# EAGLE design nrf-beacon (EAGLE 6.5.0)
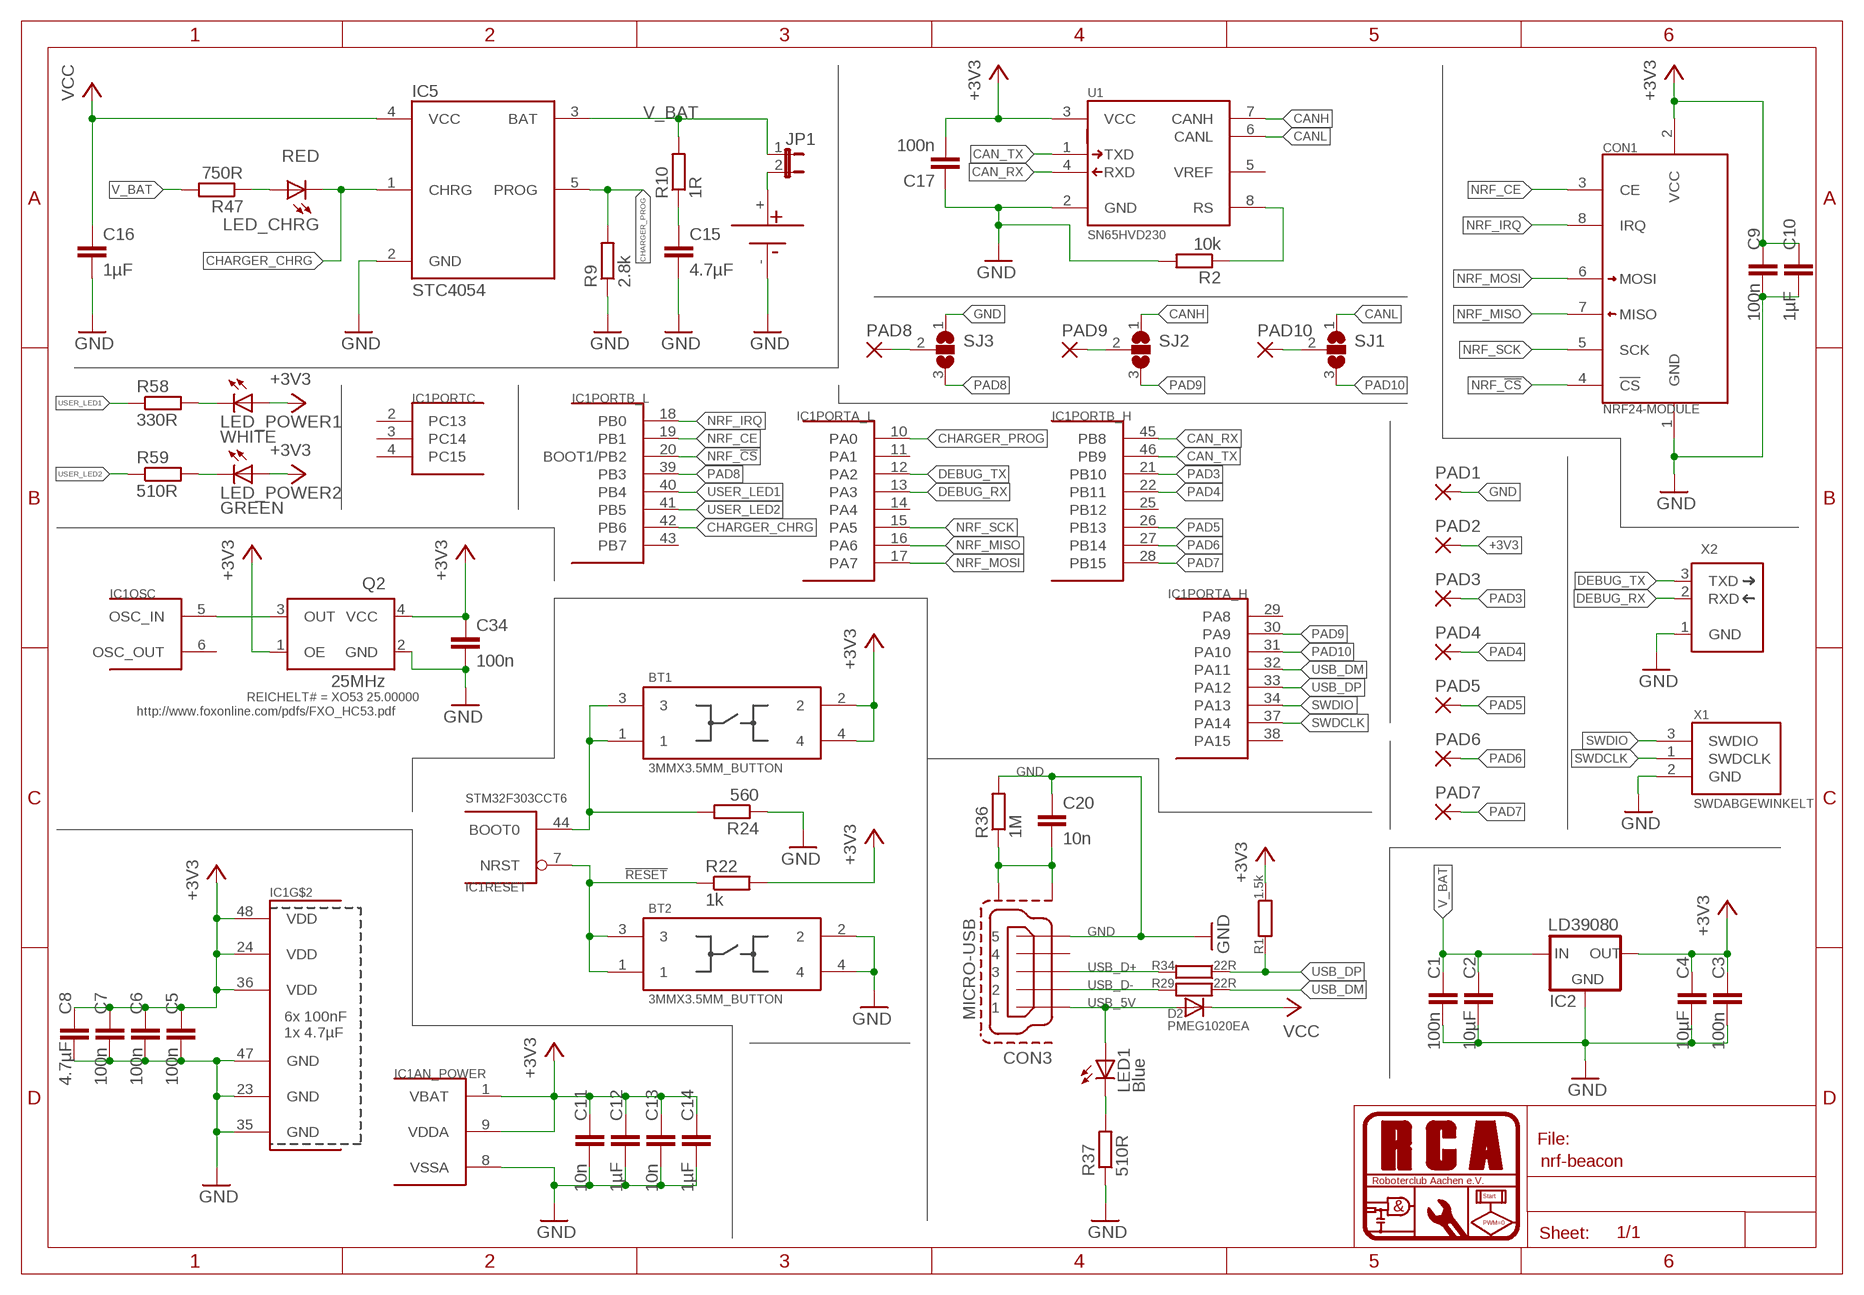
[diagram p0: schematic, sheet 1]

## Parts
BT1  3MMX3.5MM_BUTTON  [3MMX3.5MM_BUTTON]
BT2  3MMX3.5MM_BUTTON  [3MMX3.5MM_BUTTON]
C1  100n  C-EUC1206  [C1206]
C2  10µF  C-EUC1206  [C1206]
C3  100n  C-EUC1206  [C1206]
C4  10µF  C-EUC1206  [C1206]
C5  100n  C-EUC0603  [C0603]
C6  100n  C-EUC0603  [C0603]
C7  100n  C-EUC0603  [C0603]
C8  4.7µF  C-EUC0603  [C0603]
C9  100n  C-EUC0603  [C0603]
C10  1µF  C-EUC0603  [C0603]
C11  10n  C-EUC0603  [C0603]
C12  1µF  C-EUC0603  [C0603]
C13  10n  C-EUC0603  [C0603]
C14  1µF  C-EUC0603  [C0603]
C15  4.7µF  C-EUC0603  [C0603]
C16  1µF  C-EUC0603  [C0603]
C17  100n  C-EUC1206  [C1206]
C20  10n  C-EUC0805  [C0805]
C34  100n  C-EUC0603  [C0603]
CON1  NRF24-MODULE  [NRF24-MODULE]
CON3  MICRO-USB  [MICRO-USB]
D2  PMEG1020EA  DIODE-SOD323-W  [SOD323-W]
IC1  STM32F303CCT6  [TQFP48]
IC2  LD39080  [DPAK]
IC5  STC4054  [SOT23-5L]
JP1  JP1E  [JP1]
LED1  Blue  LEDCHIPLED_0805  [CHIPLED_0805]
LED_CHRG  RED  LEDCHIPLED_0805  [CHIPLED_0805]
LED_POWER1  WHITE  LEDCHIPLED_0805  [CHIPLED_0805]
LED_POWER2  GREEN  LEDCHIPLED_0805  [CHIPLED_0805]
PAD1  WIREPADSMD5-1,8  [5-1,8]
PAD2  WIREPADSMD5-1,8  [5-1,8]
PAD3  WIREPADSMD5-1,8  [5-1,8]
PAD4  WIREPADSMD5-1,8  [5-1,8]
PAD5  WIREPADSMD5-1,8  [5-1,8]
PAD6  WIREPADSMD5-1,8  [5-1,8]
PAD7  WIREPADSMD5-1,8  [5-1,8]
PAD8  WIREPADSMD5-1,8  [5-1,8]
PAD9  WIREPADSMD5-1,8  [5-1,8]
PAD10  WIREPADSMD5-1,8  [5-1,8]
Q2  25MHz  XO53  [XO53]
R1  1.5k  R-EU_M0805  [M0805]
R2  10k  R-EU_R0805  [R0805]
R9  2.8k  R-EU_R0603  [R0603]
R10  1R  R-EU_R0805  [R0805]
R22  1k  R-EU_R0603  [R0603]
R24  560  R-EU_R0805  [R0805]
R29  22R  R-EU_M0805  [M0805]
R34  22R  R-EU_M0805  [M0805]
R36  1M  R-EU_M0805  [M0805]
R37  510R  R-EU_M0805  [M0805]
R47  750R  R-EU_R0603  [R0603]
R58  330R  R-EU_R0603  [R0603]
R59  510R  R-EU_R0603  [R0603]
SJ1  SJ2W  [SJ_2]
SJ2  SJ2W  [SJ_2]
SJ3  SJ2W  [SJ_2]
U1  SN65HVD230  [SOIC-8]
U$1  BAT  [BAT]
X1  SWDABGEWINKELT  [7395-03]
X2  SERIAL_DEBUG_3PINL  [7395-03]

## Nets
!RESET: BT2.1 BT2.3 IC1.7(RESET:NRST) R22.1
$234: PAD10.1(P) SJ1.2
$6757: PAD8.1(P) SJ3.2
+3V3: BT1.2 BT1.4 C3.1 C4.1 C5.1 C6.1 C7.1 C8.1 C9.1 C10.1 C11.1 C12.1 C13.1 C14.1 C17.2 C34.1 CON1.2(VCC) IC1.1(AN_POWER:VBAT) IC1.9(AN_POWER:VDDA) IC1.24(VDD) IC1.36(VDD) IC1.48(VDD) IC2.3(OUT) LED_POWER1.A LED_POWER2.A PAD2.1(P) Q2.1(OE) Q2.4(VCC) R1.1 R22.2 U1.3(VCC)
CAN_RX: IC1.45(PORTB_H:PB8) U1.4(RXD)
CAN_TX: IC1.46(PORTB_H:PB9) U1.1(TXD)
CANH: SJ2.1 U1.7(CANH)
CANL: SJ1.1 U1.6(CANL)
CHARGER_CHRG: IC1.42(PORTB_L:PB6) IC5.1(CHRG) LED_CHRG.C
CHARGER_PROG: IC1.10(PORTA_L:PA0) IC5.5(PROG) R9.2
DEBUG_RX: IC1.13(PORTA_L:PA3) X2.2(RXD)
DEBUG_TX: IC1.12(PORTA_L:PA2) X2.3(TXD)
GND: BT2.2 BT2.4 C1.2 C2.2 C3.2 C4.2 C5.2 C6.2 C7.2 C8.2 C9.2 C10.2 C11.2 C12.2 C13.2 C14.2 C15.2 C16.2 C17.1 C20.1 C34.2 CON1.1(GND) CON3.5 IC1.8(AN_POWER:VSSA) IC1.23(GND) IC1.35(GND) IC1.47(GND) IC2.2(GND) IC5.2(GND) PAD1.1(P) Q2.2(GND) R2.2 R9.1 R24.1 R36.2 R37.1 SJ3.1 U1.2(GND) U$1.- X1.2(GND) X2.1(GND)
N$1: JP1.2 U$1.+
N$2: BT1.1 BT1.3 IC1.44(RESET:BOOT0) R24.2
N$3: R2.1 U1.8(RS)
N$4: PAD9.1(P) SJ2.2
N$11: C20.2 CON3.SHIELDING1 CON3.SHIELDING2 R36.1
N$17: LED1.C R37.2
N$19: C15.1 R10.1
N$20: LED_POWER1.C R58.2
N$23: LED_CHRG.A R47.1
N$39: IC1.5(OSC:OSC_IN) Q2.3(OUT)
N$50: LED_POWER2.C R59.2
NRF_!CS: CON1.4(!CS) IC1.20(PORTB_L:BOOT1/PB2)
NRF_CE: CON1.3(CE) IC1.19(PORTB_L:PB1)
NRF_IRQ: CON1.8(IRQ) IC1.18(PORTB_L:PB0)
NRF_MISO: CON1.7(MISO) IC1.16(PORTA_L:PA6)
NRF_MOSI: CON1.6(MOSI) IC1.17(PORTA_L:PA7)
NRF_SCK: CON1.5(SCK) IC1.15(PORTA_L:PA5)
PAD3: IC1.21(PORTB_H:PB10) PAD3.1(P)
PAD4: IC1.22(PORTB_H:PB11) PAD4.1(P)
PAD5: IC1.26(PORTB_H:PB13) PAD5.1(P)
PAD6: IC1.27(PORTB_H:PB14) PAD6.1(P)
PAD7: IC1.28(PORTB_H:PB15) PAD7.1(P)
PAD8: IC1.39(PORTB_L:PB3) SJ3.3
PAD9: IC1.30(PORTA_H:PA9) SJ2.3
PAD10: IC1.31(PORTA_H:PA10) SJ1.3
SWDCLK: IC1.37(PORTA_H:PA14) X1.1(SWDCLK)
SWDIO: IC1.34(PORTA_H:PA13) X1.3(SWDIO)
USB_5V: CON3.1 D2.A LED1.A
USB_D+: CON3.3 R34.2
USB_D-: CON3.2 R29.2
USB_DM: IC1.32(PORTA_H:PA11) R29.1
USB_DP: IC1.33(PORTA_H:PA12) R1.2 R34.1
USER_LED1: IC1.40(PORTB_L:PB4) R58.1
USER_LED2: IC1.41(PORTB_L:PB5) R59.1
V_BAT: C1.1 C2.1 IC2.1(IN) IC5.3(BAT) JP1.1 R10.2 R47.2
VCC: C16.1 D2.C IC5.4(VCC)
Unconnected: CON3.4 IC1.2(PORTC:PC13) IC1.3(PORTC:PC14) IC1.4(PORTC:PC15) IC1.6(OSC:OSC_OUT) IC1.11(PORTA_L:PA1) IC1.14(PORTA_L:PA4) IC1.25(PORTB_H:PB12) IC1.29(PORTA_H:PA8) IC1.38(PORTA_H:PA15) IC1.43(PORTB_L:PB7) U1.5(VREF)

## Notes on the sheet
- http://www.foxonline.com/pdfs/FXO_HC53.pdf

## Library data of the parts
BT1 BT2 = rca_sontiges:3MMX3.5MM_BUTTON
C1-C8 C11-C16 = rcl:C-EU: CAPACITOR, European symbol
C9 C10 = resistor:C-EU: CAPACITOR, European symbol
C17 = resistor:C-EU: CAPACITOR, European symbol; RCA#: C0603 100n
C20 = resistor:C-EU: CAPACITOR, European symbol; RCA#: C0805 10n
C34 = rcl:C-EU: CAPACITOR, European symbol; RCA#: C0603 100n
CON1 = rca_sontiges:NRF24-MODULE: NRF24L01+ 2.4GHz wireless module
CON3 = rca_stecker:MICRO-USB
D2 = diode:DIODE-: DIODE; MANF: NXP; SAMPLE#: PMEG1020EA
IC1 = stm32:STM32F303CCT6: ST STM32F101/103 48pin LQFP
IC2 = rca_spgversorgung:LD39080: Ultra low drop BICMOS voltage regulator - 0.8A Guaranteed output current - Ultra low dropout voltage (150mV typ. @ 0.8A load, 20mV typ. @150mA load)
IC5 = rca_ic:STC4054: 800mA Standalone linear Li-Ion Battery charger programmable charge current up to 800mA No external MOSFET, sense resistors or blocking diode required Constant current / constant voltage operation with thermal regulation to maximize charge rate without risk of overheating Charges single cell li-ion batteries directly from USB port Preset 4.2V charge voltage with 1% accuracy Automatic recharge Single charge status output pin Charge current monitor output for gas gauging C/10 Charge termination 25μA supply current in shutdown mode Low battery voltage detect for precharge setting Soft-start limits inrush current TSOT23-5L package
JP1 = jumper:JP1E: JUMPER
LED1 = led:LED: LED OSRAM: - CHIPLED LG R971, LG N971, LY N971, LG Q971, LY Q971, LO R971, LY R971 LH N974, LH R974 LS Q976, LO Q976, LY Q976 LO Q996 - Hyper CHIPLED LW Q18S LB Q993, LB Q99A, LB R99A - SideLED LS A670, LO A670, LY A670, LG A670, LP A670 LB A673, LV A673, LT A673, LW A673 LH A674 LY A675 LS A676, LA A676, LO A676, LY A676, LW A676 LS A679, LY A679, LG A679 - Hyper Micro SIDELED® LS Y876, LA Y876, LO Y876, LY Y876 LT Y87S - SmartLED LW L88C, LW L88S LB L89C, LB L89S, LG L890 LS L89K, LO L89K, LY L89K LS L896, LA L896, LO L896, LY L896 - TOPLED LS T670, LO T670, LY T670, LG T670, LP T670 LSG T670, LSP T670, LSY T670, LOP T670, LYG T670 LG T671, LOG T671, LSG T671 LB T673, LV T673, LT T673, LW T673 LH T674 LS T676, LA T676, LO T676, LY T676, LB T676, LH T676, LSB T676, LW T676 LB T67C, LV T67C, LT T67C, LS T67K, LO T67K, LY T67K, LW E67C LS E67B, LA E67B, LO E67B, LY E67B, LB E67C, LV E67C, LT E67C LW T67C LS T679, LY T679, LG T679 LS T770, LO T770, LY T770, LG T770, LP T770 LB T773, LV T773, LT T773, LW T773 LH T774 LS E675, LA E675, LY E675, LS T675 LS T776, LA T776, LO T776, LY T776, LB T776 LHGB T686 LT T68C, LB T68C - Hyper Mini TOPLED® LB M676 - Mini TOPLED Santana® LG M470 LS M47K, LO M47K, LY M47K Source: http://www.osram.convergy.de LUXEON: - LUMILED® LXK2-PW12-R00, LXK2-PW12-S00, LXK2-PW14-U00, LXK2-PW14-V00 LXK2-PM12-R00, LXK2-PM12-S00, LXK2-PM14-U00 LXK2-PE12-Q00, LXK2-PE12-R00, LXK2-PE12-S00, LXK2-PE14-T00, LXK2-PE14-U00 LXK2-PB12-K00, LXK2-PB12-L00, LXK2-PB12-M00, LXK2-PB14-N00, LXK2-PB14-P00, LXK2-PB14-Q00 LXK2-PR12-L00, LXK2-PR12-M00, LXK2-PR14-Q00, LXK2-PR14-R00 LXK2-PD12-Q00, LXK2-PD12-R00, LXK2-PD12-S00 LXK2-PH12-R00, LXK2-PH12-S00 LXK2-PL12-P00, LXK2-PL12-Q00, LXK2-PL12-R00 Source: www.luxeon.com KINGBRIGHT: KA-3528ASYC Source: www.kingbright.com; REICHELT#: SMD-LED 0805 BL
LED_CHRG = led:LED: LED OSRAM: - CHIPLED LG R971, LG N971, LY N971, LG Q971, LY Q971, LO R971, LY R971 LH N974, LH R974 LS Q976, LO Q976, LY Q976 LO Q996 - Hyper CHIPLED LW Q18S LB Q993, LB Q99A, LB R99A - SideLED LS A670, LO A670, LY A670, LG A670, LP A670 LB A673, LV A673, LT A673, LW A673 LH A674 LY A675 LS A676, LA A676, LO A676, LY A676, LW A676 LS A679, LY A679, LG A679 - Hyper Micro SIDELED® LS Y876, LA Y876, LO Y876, LY Y876 LT Y87S - SmartLED LW L88C, LW L88S LB L89C, LB L89S, LG L890 LS L89K, LO L89K, LY L89K LS L896, LA L896, LO L896, LY L896 - TOPLED LS T670, LO T670, LY T670, LG T670, LP T670 LSG T670, LSP T670, LSY T670, LOP T670, LYG T670 LG T671, LOG T671, LSG T671 LB T673, LV T673, LT T673, LW T673 LH T674 LS T676, LA T676, LO T676, LY T676, LB T676, LH T676, LSB T676, LW T676 LB T67C, LV T67C, LT T67C, LS T67K, LO T67K, LY T67K, LW E67C LS E67B, LA E67B, LO E67B, LY E67B, LB E67C, LV E67C, LT E67C LW T67C LS T679, LY T679, LG T679 LS T770, LO T770, LY T770, LG T770, LP T770 LB T773, LV T773, LT T773, LW T773 LH T774 LS E675, LA E675, LY E675, LS T675 LS T776, LA T776, LO T776, LY T776, LB T776 LHGB T686 LT T68C, LB T68C - Hyper Mini TOPLED® LB M676 - Mini TOPLED Santana® LG M470 LS M47K, LO M47K, LY M47K Source: http://www.osram.convergy.de LUXEON: - LUMILED® LXK2-PW12-R00, LXK2-PW12-S00, LXK2-PW14-U00, LXK2-PW14-V00 LXK2-PM12-R00, LXK2-PM12-S00, LXK2-PM14-U00 LXK2-PE12-Q00, LXK2-PE12-R00, LXK2-PE12-S00, LXK2-PE14-T00, LXK2-PE14-U00 LXK2-PB12-K00, LXK2-PB12-L00, LXK2-PB12-M00, LXK2-PB14-N00, LXK2-PB14-P00, LXK2-PB14-Q00 LXK2-PR12-L00, LXK2-PR12-M00, LXK2-PR14-Q00, LXK2-PR14-R00 LXK2-PD12-Q00, LXK2-PD12-R00, LXK2-PD12-S00 LXK2-PH12-R00, LXK2-PH12-S00 LXK2-PL12-P00, LXK2-PL12-Q00, LXK2-PL12-R00 Source: www.luxeon.com KINGBRIGHT: KA-3528ASYC Source: www.kingbright.com; REICHELT#: SMD-LED 0805 RT
LED_POWER1 LED_POWER2 = led:LED: LED OSRAM: - CHIPLED LG R971, LG N971, LY N971, LG Q971, LY Q971, LO R971, LY R971 LH N974, LH R974 LS Q976, LO Q976, LY Q976 LO Q996 - Hyper CHIPLED LW Q18S LB Q993, LB Q99A, LB R99A - SideLED LS A670, LO A670, LY A670, LG A670, LP A670 LB A673, LV A673, LT A673, LW A673 LH A674 LY A675 LS A676, LA A676, LO A676, LY A676, LW A676 LS A679, LY A679, LG A679 - Hyper Micro SIDELED® LS Y876, LA Y876, LO Y876, LY Y876 LT Y87S - SmartLED LW L88C, LW L88S LB L89C, LB L89S, LG L890 LS L89K, LO L89K, LY L89K LS L896, LA L896, LO L896, LY L896 - TOPLED LS T670, LO T670, LY T670, LG T670, LP T670 LSG T670, LSP T670, LSY T670, LOP T670, LYG T670 LG T671, LOG T671, LSG T671 LB T673, LV T673, LT T673, LW T673 LH T674 LS T676, LA T676, LO T676, LY T676, LB T676, LH T676, LSB T676, LW T676 LB T67C, LV T67C, LT T67C, LS T67K, LO T67K, LY T67K, LW E67C LS E67B, LA E67B, LO E67B, LY E67B, LB E67C, LV E67C, LT E67C LW T67C LS T679, LY T679, LG T679 LS T770, LO T770, LY T770, LG T770, LP T770 LB T773, LV T773, LT T773, LW T773 LH T774 LS E675, LA E675, LY E675, LS T675 LS T776, LA T776, LO T776, LY T776, LB T776 LHGB T686 LT T68C, LB T68C - Hyper Mini TOPLED® LB M676 - Mini TOPLED Santana® LG M470 LS M47K, LO M47K, LY M47K Source: http://www.osram.convergy.de LUXEON: - LUMILED® LXK2-PW12-R00, LXK2-PW12-S00, LXK2-PW14-U00, LXK2-PW14-V00 LXK2-PM12-R00, LXK2-PM12-S00, LXK2-PM14-U00 LXK2-PE12-Q00, LXK2-PE12-R00, LXK2-PE12-S00, LXK2-PE14-T00, LXK2-PE14-U00 LXK2-PB12-K00, LXK2-PB12-L00, LXK2-PB12-M00, LXK2-PB14-N00, LXK2-PB14-P00, LXK2-PB14-Q00 LXK2-PR12-L00, LXK2-PR12-M00, LXK2-PR14-Q00, LXK2-PR14-R00 LXK2-PD12-Q00, LXK2-PD12-R00, LXK2-PD12-S00 LXK2-PH12-R00, LXK2-PH12-S00 LXK2-PL12-P00, LXK2-PL12-Q00, LXK2-PL12-R00 Source: www.luxeon.com KINGBRIGHT: KA-3528ASYC Source: www.kingbright.com; REICHELT#: SMD-LED 0805 GN
PAD1-PAD10 = wirepad:WIREPAD: Wire PAD connect wire on PCB
Q2 = rca_clock:XO: XO91 Series Oscillators Frequency Range 500 kHz to 125 MHz Supply voltage range 1.8, 2.5, 3.3 or 5.0 Volts Gibt es in der 3,3V Version bei Reichelt (XO91 #Wert) Datenblatt: http://www.reichelt.de/?;ACTION=7;LA=6;OPEN=0;INDEX=0;FILENAME=B400%252FXO91.pdf XO53 Series Oscillators Frequency Range 2.5 MHz to 125 MHz Supply voltage range 1.8, 2.5, 3.3 Volts Gibt es in der 3,3V Version bei Reichelt (XO53 #Wert) XO32 Series Oscillators Frequency Range 8 MHz to 50 MHz Supply voltage range 1.8, 2.5, 3.3 Volts Gibt es in der 3,3V Version bei Reichelt (XO32 #Wert); REICHELT#: XO53 25.00000
R1 R29 R34 = resistor:R-EU_: RESISTOR, European symbol; RCA#: R0805 22R
R2 R9 R10 = rcl:R-EU_: RESISTOR, European symbol
R22 R24 = rcl:R-EU_: RESISTOR, European symbol; RCA#: R0603 10k
R36 = resistor:R-EU_: RESISTOR, European symbol; RCA#: R0805 1M
R37 = resistor:R-EU_: RESISTOR, European symbol; RCA#: R0805 820R
R47 = resistor:R-EU_: RESISTOR, European symbol; DIGIKEY#: RMCF0805JT820RCT-ND; RCA#: R0805 820R
R58 R59 = rcl:R-EU_: RESISTOR, European symbol; DIGIKEY#: 311-560GRCT-ND; RCA#: R0603 560R
SJ1-SJ3 = rca_sontiges:SJ2W: SMD solder JUMPER
U1 = rca_ic:SN65HVD230: 3.3V CAN Transceiver mit Split-Terminierung und Slope-Control
U$1 = akku:BAT: 1 cell battery
X1 = rca_stecker:SWD: SWD Programmierstecker SWD-Interface aus SWDIO+SWDCLK+GND für die Verwendung mit STLinkV2, andere Programmer benötigen möglicherweise auch VCC oder Reset
X2 = rca_stecker:SERIAL_DEBUG_3PIN

## Board
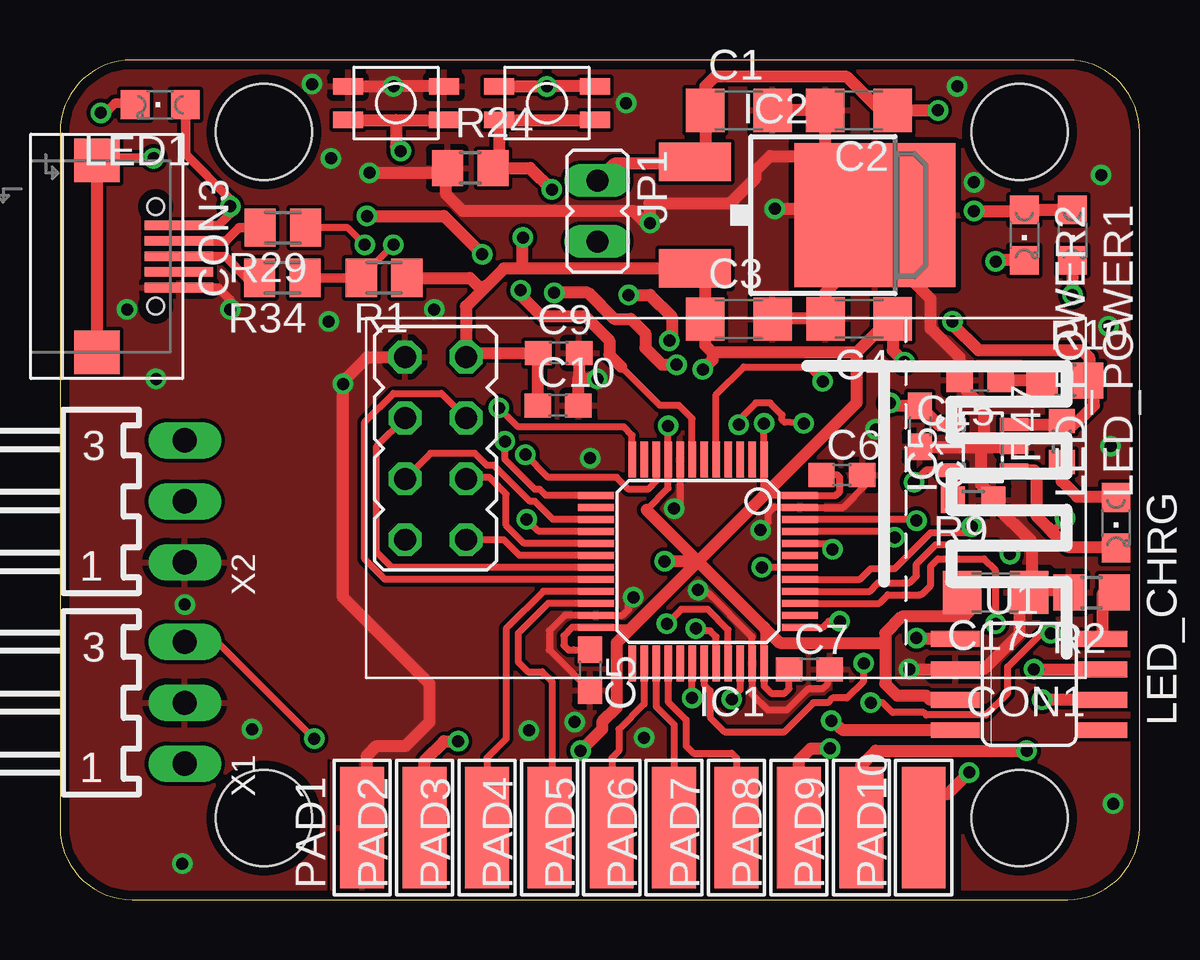
[diagram p1: board, top side]
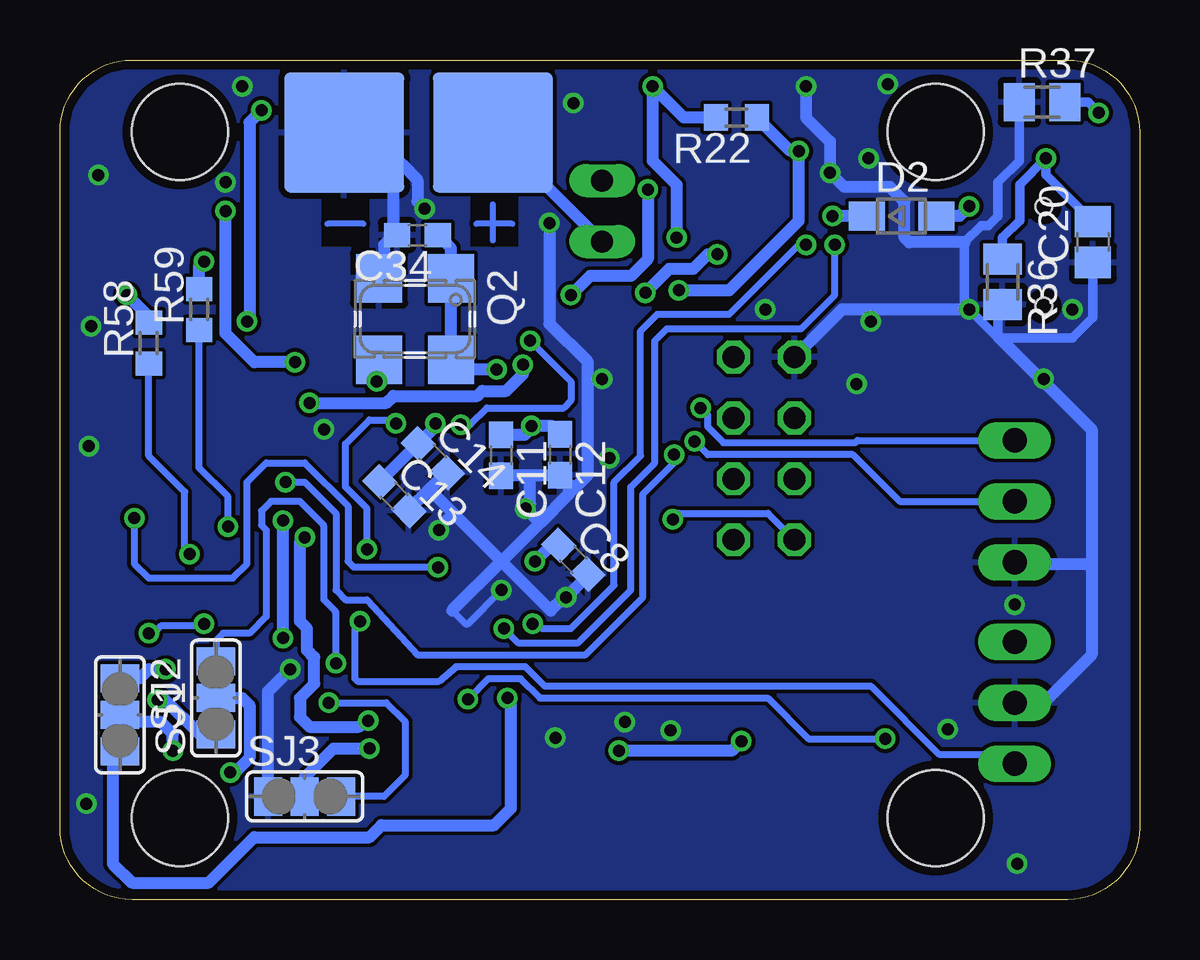
[diagram p2: board, bottom side, seen from below]

Size 45 x 35 mm. Coordinates in mm from the lower left corner, seen from the top.
Outline: 0,32 0,3 arc90 3,0 42,0 arc90 45,3 45,32 arc90 42,35 3,35 arc90 0,32
Copper layers (1*16): Top 0.0356mm / dielectric 1.5011mm / Bottom 0.0356mm
Design rules "OSHPARK *": minimum track width 6mil, minimum drill 13mil, track to track 6mil, track to pad 6mil, pad to pad 6mil, via to via 6mil, smd to smd 6mil, copper to edge 15mil, drill to drill 6mil, minimum pad ring 7mil, minimum via ring 7mil, stop-mask expansion 1mil, vias tented up to drill 0.5mm, thermal gap 10mil
Holes 4 mm at 8.5,3.4 8.5,32 40,3.4 40,32
tRestrict: 4 lines

### Footprints (pad centres in the part's own frame; a part is rotated, then mirrored left to right if it is on the bottom)
3MMX3.5MM_BUTTON = smd 0.7 x 1.25: 1 -0.7,2; 2 0.7,2; 3 -0.7,-2; 4 0.7,-2
C1206 = smd 1.6 x 1.8: 1 -1.4,0; 2 1.4,0
C0603 = smd 1.1 x 1: 1 -0.85,0; 2 0.85,0
C0805 = smd 1.3 x 1.5: 1 -0.85,0; 2 0.85,0
NRF24-MODULE = drill 0.914 octagon: 1 28.37,1.63; 2 25.83,1.63; 3 28.37,4.17; 4 25.83,4.17; 5 28.37,6.71; 6 25.83,6.71; 7 28.37,9.25; 8 25.83,9.25
MICRO-USB = smd 0.4 x 2.85: 1 -1.3,0.75; 2 -0.65,0.75; 3 0,0.75; 4 0.65,0.75; 5 1.3,0.75 | smd 1.8 x 1.9: SHIELDING1 4,-2.675; SHIELDING2 -4,-2.675 | hole 0.7: -2.075,-0.225; 2.075,-0.225
SOD323-W = smd 1.5 x 1.2: A 1.45,0; C -1.45,0
TQFP48 = smd 0.3 x 1.5: 1 -2.75,-4.25; 2 -2.25,-4.25; 3 -1.75,-4.25; 4 -1.25,-4.25; 5 -0.75,-4.25; 6 -0.25,-4.25; 7 0.25,-4.25; 8 0.75,-4.25; 9 1.25,-4.25; 10 1.75,-4.25; 11 2.25,-4.25; 12 2.75,-4.25; 25 2.75,4.25; 26 2.25,4.25; 27 1.75,4.25; 28 1.25,4.25; 29 0.75,4.25; 30 0.25,4.25; 31 -0.25,4.25; 32 -0.75,4.25; 33 -1.25,4.25; 34 -1.75,4.25; 35 -2.25,4.25; 36 -2.75,4.25 | smd 1.5 x 0.3: 13 4.25,-2.75; 14 4.25,-2.25; 15 4.25,-1.75; 16 4.25,-1.25; 17 4.25,-0.75; 18 4.25,-0.25; 19 4.25,0.25; 20 4.25,0.75; 21 4.25,1.25; 22 4.25,1.75; 23 4.25,2.25; 24 4.25,2.75; 37 -4.25,2.75; 38 -4.25,2.25; 39 -4.25,1.75; 40 -4.25,1.25; 41 -4.25,0.75; 42 -4.25,0.25; 43 -4.25,-0.25; 44 -4.25,-0.75; 45 -4.25,-1.25; 46 -4.25,-1.75; 47 -4.25,-2.25; 48 -4.25,-2.75
DPAK = smd 1.6 x 3: 1 -2.223,-4.5; 3 2.223,-4.5 | smd 6 x 6.7: 2 0,3
SOT23-5L = smd 0.55 x 1.2: 1 -0.95,-1.3; 2 0,-1.3; 3 0.95,-1.3; 4 0.95,1.3; 5 -0.95,1.3
JP1 = drill 0.914 long: 1 0,-1.27; 2 0,1.27
CHIPLED_0805 = smd 1.2 x 1.2: A 0,-1.05; C 0,1.05
5-1,8 = smd 1.829 x 5.08: 1 0,0
XO53 = smd 1.93 x 2.032: 1 -1.5,-1.7; 2 1.5,-1.7; 3 1.5,1.7; 4 -1.5,1.7
M0805 = smd 1.3 x 1.6: 1 -0.95,0; 2 0.95,0
R0805 = smd 1.3 x 1.5: 1 -0.95,0; 2 0.95,0
R0603 = smd 1 x 1.1: 1 -0.85,0; 2 0.85,0
SJ_2 = smd 1.168 x 1.6: 1 -1.524,0; 2 0,0; 3 1.524,0
SOIC-8 = smd 2.032 x 0.66: 1 -3.073,1.27; 2 -3.073,0; 3 -3.073,-1.27; 4 -3.073,-2.54; 5 3.073,-2.54; 6 3.073,-1.27; 7 3.073,0; 8 3.073,1.27
BAT = smd 5 x 5: + -3.1,0; - 3.1,0
7395-03 = drill 1.016 long: 1 -2.54,0; 2 0,0; 3 2.54,0

### Placement (x,y rotation side)
BT1  20.3,33.2 90 top
BT2  14,33.2 90 top
C1  28.3,32.9 0 top
C2  33.3,32.9 180 top
C3  28.3,24.2 0 top
C4  33.31,24.21 180 top
C5  22.09,9.56 270 top
C6  32.59,17.69 0 top
C7  31.24,9.59 0 top
C8  23.6,14.17 315 bottom
C9  20.79,22.79 0 top
C10  20.76,20.59 0 top
C11  26.61,18.52 270 bottom
C12  24.16,18.54 270 bottom
C13  31.06,16.82 315 bottom
C14  29.46,18.4 315 bottom
C15  38.35,21.66 180 top
C16  35.84,19.73 270 top
C17  39,12.8 180 top
C20  1.94,27.41 90 bottom
C34  30.1,27.7 180 bottom
CON1  42.75,24.25 180 top
CON3  4.21,26.81 270 top
D2  9.92,28.49 0 bottom
IC1  26.6,14.1 180 top
IC2  30.97,28.53 270 top
IC5  38.47,18.85 90 top
JP1  22.4,28.7 180 top
LED1  4.18,33.13 90 top
LED_CHRG  44.02,15.71 180 top
LED_POWER1  42.2,27.7 180 top
LED_POWER2  40.2,27.7 180 top
PAD1  12.6,3 0 top
PAD2  15.2,3 0 top
PAD3  17.8,3 0 top
PAD4  20.4,3 0 top
PAD5  23,3 0 top
PAD6  25.6,3 0 top
PAD7  28.2,3 0 top
PAD8  30.8,3 0 top
PAD9  33.4,3 0 top
PAD10  36,3 0 top
Q2  30.2,24.2 180 bottom
R1  13.51,25.91 180 top
R2  43,12.8 180 top
R9  38.06,16.66 180 top
R10  41.89,21.64 0 top
R22  16.8,32.6 180 bottom
R24  17.1,30.5 0 top
R29  9.29,28.01 180 top
R34  9.27,25.91 180 top
R36  5.71,25.75 270 bottom
R37  4.06,33.24 0 bottom
R47  41.76,19.09 90 top
R58  41.3,23.2 90 bottom
R59  39.2,24.6 90 bottom
SJ1  38.5,8.4 90 bottom
SJ2  42.5,7.7 270 bottom
SJ3  34.8,4.3 0 bottom
U1  40.4,9.6 0 top
U$1  30.05,31.97 180 bottom
X1  5.2,8.2 90 top
X2  5.2,16.6 90 top

### Tracks (layer width: path | path; a pad name or v marks a point on that pad's centre or on a via)
!RESET  (via drill 0.5)
  Top 0.3: IC1.7 26.35,20.05 25.8,20.6 25,20.6 23.4,22.2
  Top 0.5: BT2.1 14,32.5 | 14,32.5 BT2.3 | 14,32.5 14,31.4 v14.2,31.2 | v19.2,25.4 19.2,25.2 20.1,24.3 21.9,24.3 22.9,23.3 22.9,22.7 23.4,22.2
  Bottom 0.5: R22.1 14.55,31.2 v14.2,31.2 14.2,28.3 17.1,25.4 v19.2,25.4
$234  (via drill 0.5)
  Top 0.5: PAD10.1 36,4.4 37,4.4 v37.9,5.3
  Bottom 0.5: SJ1.2 37.4,8.4 37.1,8.1 37.1,5.9 37.7,5.3 v37.9,5.3
$6757  (via drill 0.5)
  Top 0.5: PAD8.1 30.8,5.8 31.3,6.3 v32.1,6.3
  Bottom 0.5: SJ3.2 34.8,5.1 33.6,6.3 v32.1,6.3
+3V3  (via drill 0.5)
  Top 0.3: 24.45,16.25 25.35,17.15 IC1.9 v25.35,19.75 | 29.45,16.95 29.35,17.05 IC1.1 v29.35,19.85 | 23.75,11.35 23.8,11.3 | 23.9,11.4 23.85,11.35 IC1.24 21.35,11.35 21,11 21,10.6 21.2,10.4 21.4,10.4 21.41,10.41 C5.1 | 29.35,11.35 IC1.36 29.35,8.9 29.65,8.6 30.2,8.6 30.39,8.79 C7.1 30.2,9.6 | 29.4,16.9 29.45,16.85 IC1.48 32.35,16.85 32.5,17 32.5,17.6 32.4,17.7 C6.1
  Top 0.4: R1.1 14.77,25.6 | 17.4,25.6 17.8,25.6
  Top 0.5: C17.2 38.05,12.15 37.7,11.8 35.1,11.8 34.4,11.1 34.4,10.7 | 33.2,22.8 34.61,24.21 C4.1 34.71,22.89 v35.2,22.4 | 33.2,22.8 27.2,22.8 | 27.2,22.8 26.9,23.1 C3.1 26.9,25.88 IC2.3 19.27,26.31 | 19.27,26.31 18.51,26.31 17.8,25.6 16.92,24.72 CON1.2 17.09,22.79 C9.1 19.91,22.79 C10.1 | 33.2,22.8 33.2,20.7 29.45,16.95 29.4,16.9 26.6,14.1 | 26.6,14.1 23.9,11.4 23.8,11.3 23.2,10.7 23.2,8 22.6,7.4 22.6,7.1 v21.7,6.2 | 26.6,14.1 29.35,11.35 30,10.7 34.4,10.7 | 26.6,14.1 24.45,16.25 | 26.6,14.1 v25.2,14.1 | LED_POWER1.A LED_POWER2.A 40.75,28.7 v38.1,28.7 | 27.2,22.8 27.2,22.5 v26.8,22.1 | R1.1 17.09,25.91 17.4,25.6 | BT1.4 v20.3,33.9 BT1.2 | 38,13.3 38,12.85 C17.2 | 19.27,26.31 19.27,27.47 v19.3,27.6 | U1.3 36.27,8.33 36.1,8.5 34.9,8.5 34.4,9 34.4,10.7 | PAD2.1 15.2,5.8 16,6.6 v16.6,6.6 | 37.4,13.4 37.4,12.98 arc45 37.46,12.84 C17.2
  Bottom 0.3: v25.35,19.75 25.4,19.6 25.4,19.8
  Bottom 0.5: C12.1 24.52,19.75 v25.35,19.75 | 25.4,19.6 25.63,19.37 C11.1 | C13.1 30.08,19 C14.1 29.35,19.71 v29.35,19.85 | v25.2,14.1 24.33,14.97 C8.1 | v35.2,22.4 36.9,22.4 38.1,23.6 v38.1,28.7 | v26.8,22.1 28.3,22.1 Q2.4 Q2.1 28.7,27.15 C34.1 | v19.3,27.6 19.3,29.8 20.3,30.8 v20.3,33.9 19,32.6 R22.2 | v16.6,6.6 17,6.2 v21.7,6.2
CAN_RX  (via drill 0.5)
  Top 0.3: v34.8,15.1 34.55,15.35 IC1.45
  Top 0.5: U1.4 32.64,7.06 v32.15,7.45
  Bottom 0.5: v34.8,15.1 35,14.9 35,11.6 34.7,11.3 34.7,10.4 34.4,10.1 34.4,9 35,8.4 35,7.6 34.6,7.2 32.55,7.2 v32.15,7.45
CAN_TX  (via drill 0.5)
  Top 0.3: v35.7,15.8 35.65,15.85 IC1.46
  Top 0.5: U1.1 35.83,10.87 v35.7,10.9
  Bottom 0.5: v35.7,10.9 v35.7,15.8
CANH  (via drill 0.5)
  Top 0.5: v40.6,9.6 U1.7
  Bottom 0.5: SJ2.1 41.68,9.22 41.3,9.6 v40.6,9.6
CANL  (via drill 0.5)
  Top 0.5: U1.6 v40.93,8.33
  Bottom 0.5: SJ1.1 39.18,6.88 40.63,8.33 v40.93,8.33
CHARGER_CHRG  (via drill 0.5)
  Top 0.3: 41.2,15.5 41.5,15.5 v41.9,15.9 | IC1.42 v29.25,13.85
  Top 0.5: IC5.1 40.6,17.9 40.7,17.8 40.7,16 41.2,15.5 42,14.7 43.98,14.7 LED_CHRG.C
  Bottom 0.3: v41.9,15.9 41.9,14 41.3,13.4 37.8,13.4 37.2,14 37.2,17.4 36.4,18.2 34.8,18.2 33,16.4 33,14.1 32.75,13.85 v29.25,13.85
CHARGER_PROG  (via drill 0.5)
  Top 0.3: IC5.5 36.1,17.9 v35.6,17.4 | IC1.10 24.85,17.45 24.5,17.1 23.7,17.1 23.2,17.6 20.35,17.6 v19.4,18.55 19.5,18.4
  Top 0.5: R9.2 37.21,17.86 IC5.5
  Bottom 0.3: v35.6,17.4 34.8,17.4 33.5,16.1 33.5,12.9 33.1,12.5 32.2,12.5 30.1,10.2 23.1,10.2 20.7,12.6 20.7,16.9 19.4,18.2 v19.4,18.55
DEBUG_RX  (via drill 0.5)
  Top 0.3: IC1.13 20.25,16.85 20,17.1 19.8,17.1 18.55,18.35 v18.55,19.1
  Bottom 0.3: X2.2 10,16.6 11.95,18.55 18,18.55 v18.55,19.1
DEBUG_TX  (via drill 0.5)
  Top 0.3: IC1.12 23.85,19.35 23.5,19.7 19.1,19.7 v18.3,20.5
  Bottom 0.3: X2.3 11.76,19.14 11.85,19.05 17.35,19.05 18,19.7 18,20.2 v18.3,20.5
GND  (via drill 0.5)
  Top 0.3: v23.9,12.6 23.7,12.4 23.7,12.1 23.45,11.85 IC1.23 21.05,11.85 20.4,11.2 20.4,10.4 C5.2 | v29.2,15.4 29.5,15.7 29.5,16.1 29.75,16.35 IC1.47 32.65,16.35 33.64,17.34 C6.2 | IC1.8 25.85,16.55 v25.6,16.3 | v26.6,12.9 27,12.8 28.85,10.95 IC1.35 28.85,8.55 29.5,7.9 30.3,7.9 31.2,8.8 31.8,8.8 32,9 32,9.5 C7.2 32.2,9.48
  Top 0.4: CON3.5 6.6,25.5 7.1,25 v7.1,24.6
  Top 0.5: v35.4,9.6 U1.2 38.5,9.6 40,11.1 40,12.55 C17.1 40.5,12.9 | IC2.2 33.97,27.37 | 33.97,27.37 31.9,25.3 C4.2 C3.2 | C1.2 C2.2 31.9,31.1 32.8,30.2 | IC2.2 33.97,28.57 | 32.8,30.2 33.97,29.03 33.97,28.57 | IC5.2 38.5,18.85 | 38.5,18.85 35.87,18.85 C16.2 | 38.5,18.85 38.4,18.75 38.4,17.3 38.91,16.79 R9.1 38.91,16.49 40.5,14.9 40.5,12.9 | 38.5,18.85 38.5,20.5 37.8,21.2 C15.2 37.5,22.6 36.3,23.8 36.3,25.04 33.97,27.37 | 33.97,28.57 31.4,26 | 32.8,30.2 33.2,30.6 33.2,30.8 33,31 29.6,31 29,30.4 29,30.1 27.93,29.03 24.57,29.03 24.57,28.23 v24.6,28.2 24.4,28.2 23.9,28.7 16.8,28.7 16.1,29.4 16.1,30.45 R24.1 15.95,30.3 v12.9,30.3 | v29.8,28.8 33.7,28.8 IC2.2 | BT2.2 v13.9,33.9 BT2.4 | 22.02,21.7 v22.4,21.7 | PAD1.1 12.8,3.2 12.8,6 13.2,6.4 14.4,6.4 15.4,7.4 15.4,9 11.8,12.6 11.8,21.6 12.82,22.62 CON1.1 | C9.2 21.64,21.7 v22.4,21.7 | C10.2 21.61,21.7 v22.4,21.7 | 40.5,12.9 41.95,12.9 R2.2
  Bottom 0.3: v23.9,12.6 24,12.6 | 28.65,12.05 28.1,11.5 28,11.5 v26.6,12.9
  Bottom 0.4: R37.1 5.01,30.79 5.9,29.9 5.9,28.5 6.3,28.1 6.6,28.1 7.3,27.4 7.3,24.8 v7.1,24.6 5.9,23.4 | C20.1 1.94,24.26 2.8,23.4 5.9,23.4 | 5.9,23.4 5.9,23.5 5.9,24.61 R36.2
  Bottom 0.5: SJ3.1 36.32,8.68 v35.4,9.6 | 23,21.7 23,17.7 23.8,16.9 | 23,21.7 23,22.4 24.6,24 v24.6,28.2 | 23.8,16.9 25,15.7 | 25,15.7 26.5,14.2 | 26.5,14.2 26.6,14.1 | 26.6,14.1 28.65,12.05 | 26.6,14.1 24.55,12.05 24,12.6 | 26.5,14.2 26.7,14.2 28.6,16.1 | v29.2,15.4 29.2,15.5 28.6,16.1 | 23.8,16.9 23.8,17.33 C12.2 26.59,17.69 C11.2 | 25,15.7 v25.6,16.3 25.4,16.5 25.4,17.6 | 28.6,16.1 29.6,17.1 | 29.6,17.1 28.9,17.8 C14.2 | 29.6,17.1 30.46,16.24 C13.2 | v23.9,12.6 23,13.5 C8.2 | U$1.- 32.07,31.97 30.75,30.65 | 30.75,30.65 30.1,30 30.1,29.1 v29.8,28.8 | C34.2 31.1,27.7 | 31.1,27.7 31.5,27.3 31.5,26.1 Q2.2 | 31.1,27.7 31.1,30.3 30.75,30.65 | v13.9,33.9 13.9,32.6 12.9,31.6 v12.9,30.3 12.3,29.7 10.4,29.7 9.8,29.1 9.8,27.6 9.6,27.4 7.3,27.4 | v7.1,24.6 12.4,24.6 CON1.1 | 5.9,23.5 2,19.6 2,14 | 2,14 2,10.2 4,8.2 X1.2 | X2.1 5.14,14 2,14 | v22.4,21.7 23,21.7
  other vias: 15.6,24.6 43.9,4 21.45,7.4 19.55,7.05 24.35,6.75 5.1,1.5 11.3,30.9 10.5,34 2.8,24.6 23.6,33.2 37.4,33.9 43.4,30.2 38.1,29.9 43.7,23.9 43.8,18.9 34,19.6 22.1,18.4 8,7.1 11.2,24.1 4,21.7 11.8,21.5 5.2,12.3
  pour Top: 0,0 45,0 45,35 0,35
  pour Bottom: 0,0 45,0 45,35 0,35
N$1
  Bottom 0.5: U$1.+ 23.11,28.13 JP1.2
N$2  (via drill 0.5)
  Top 0.3: IC1.44 32.25,14.85 v32.2,14.6 | v31,19.85 30.2,19.9 30.1,20 30.1,20.2 29.6,20.7 29,20.7 28.3,20 v28.3,19.8
  Top 0.5: BT1.3 BT1.1 18.3,30.75 R24.2 19.6,30.5 v20.5,29.6 | v23.7,25.2 24.6,25.2 25.5,24.3 25.5,23.4 v25.4,23.3
  Bottom 0.3: v32.2,14.6 32.2,16.3 33.1,17.2 33.1,19 32.1,20 31.1,20 v31,19.85 | v28.3,19.8 27.9,19.8 27.2,20.5 24,20.5 23.7,20.8 23.7,21.6 v25.4,23.3
  Bottom 0.5: v20.5,29.6 20.5,26.7 21.2,26 22.9,26 v23.7,25.2
N$3
  Top 0.5: U1.8 43.47,12.78 R2.1
N$4  (via drill 0.5)
  Top 0.5: PAD9.1 33.4,5.6 34,6.2 v40.3,6.2
  Bottom 0.5: v40.3,6.2 40.3,6.9 40.8,7.4 42.2,7.4 SJ2.2
N$11  (via drill 0.5)
  Top 0.4: CON3.SHIELDING2 1.62,30.9 v3.9,30.9
  Top 0.5: CON3.SHIELDING2 CON3.SHIELDING1
  Bottom 0.4: R36.1 5.71,27.59 5,28.3 5,29.8 v3.9,30.9 3.9,30.22 C20.2
N$17  (via drill 0.5)
  Top 0.4: LED1.C 3.06,33.2 2.3,33.2 1.9,32.8 v1.7,32.8
  Bottom 0.4: v1.7,32.8 2.14,33.24 R37.2
N$19
  Top 0.5: R10.1 39.52,21.64 C15.1
N$20  (via drill 0.5)
  Top 0.5: LED_POWER1.C v42.2,25.2
  Bottom 0.5: R58.2 41.2,24.2 v42.2,25.2
N$23
  Top 0.5: R47.1 41.76,17.44 42.4,16.8 43.98,16.8 LED_CHRG.A
N$39  (via drill 0.5)
  Top 0.3: v31.8,21.6 31.2,22.2 28.5,22.2 27.35,21.05 IC1.5
  Bottom 0.3: v31.8,21.6 31.8,22.4 Q2.3
N$50  (via drill 0.5)
  Top 0.5: LED_POWER2.C 38.95,26.65 v39,26.6
  Bottom 0.5: R59.2 39.2,26.4 v39,26.6
NRF_!CS
  Top 0.3: IC1.20 13.55,13.35 12.7,14.2 12.7,19.9 13.9,21.1 15.9,21.1 CON1.4
NRF_CE
  Top 0.3: IC1.19 13.85,13.85 13.2,14.5 13.2,18.9 CON1.3
NRF_IRQ
  Top 0.3: IC1.18 19.15,14.35 18.5,15 CON1.8
NRF_MISO  (via drill 0.5)
  Top 0.3: IC1.16 19.95,15.35 v19.45,15.85
  Bottom 0.3: v19.45,15.85 19.2,16.1 15.48,16.1 CON1.7
NRF_MOSI
  Top 0.3: IC1.17 19.35,14.85 18.6,15.6 18.6,16.9 17.9,17.6 16.98,17.6 CON1.6
NRF_SCK
  Top 0.3: IC1.15 20.55,15.85 19.8,16.6 19.6,16.6 18.1,18.1 17.8,18.1 17.3,18.6 15.44,18.6 CON1.5
PAD3
  Top 0.3: IC1.21 20.15,12.85 18.6,11.3 18.6,6.7 17.8,5.9 PAD3.1
PAD4
  Top 0.3: IC1.22 20.35,12.35 19.1,11.1 19.1,9.9 19.5,9.5 20.1,9.5 20.5,9.1 20.5,3.1 PAD4.1
PAD5
  Top 0.3: PAD5.1 23,5.9 23.3,6.2 23.3,7.1 24.35,8.15 IC1.26
PAD6
  Top 0.3: IC1.27 24.85,8.05 25.6,7.3 PAD6.1
PAD7
  Top 0.3: IC1.28 25.35,8.25 26.1,7.5 26.1,6.4 26.4,6.1 28,6.1 28.2,5.9 PAD7.1
PAD8  (via drill 0.5)
  Top 0.3: v41.3,11.1 40.9,11.1 39.5,9.7 39.5,8.6 38.6,7.7 36.1,7.7 36,7.8 34.7,7.8 34.3,8.2 v33.8,8.2 | IC1.39 34.15,12.35 34.5,12.7 35.82,12.7 arc45 35.96,12.76 36.3,13.1 36.3,13.9 36.6,14.2 38.52,14.2 39,13.72 v39,11.5
  Bottom 0.3: v39,11.5 39,11.4 40.8,11.4 41.1,11.1 v41.3,11.1 | SJ3.3 31.5,4.3 30.6,5.2 30.6,7.4 31.4,8.2 v33.8,8.2
PAD9  (via drill 0.5)
  Top 0.2: 26.35,9.8 IC1.30
  Top 0.3: v26.35,8.4 26.35,9.8
  Bottom 0.5: SJ2.3 42.8,5.88 42.8,1.5 42,0.7 38.8,0.7 36.9,2.6 32.1,2.6 31.6,3.1 26.9,3.1 26.2,3.8 26.2,8.3 v26.35,8.4
PAD10  (via drill 0.5)
  Top 0.3: IC1.31 26.85,8.95 27.1,8.7 27.1,7.6 27.7,7 30.2,7 31.4,8.2 32,8.2 32.2,8.4 32.8,8.4 33.5,9.1 v33.5,9.85
  Bottom 0.3: v33.5,9.85 33.5,11.92 arc-45 33.56,12.06 34,12.5 34,15.52 arc-45 34.06,15.66 35,16.6 36.2,16.6 36.6,16.2 36.6,15.6 36.4,15.4 36.4,11.8 37.1,11.1 38.2,11.1 38.5,10.8 SJ1.3
SWDCLK  (via drill 0.5)
  Top 0.3: IC1.37 31.8,11.35 32.05,11.6 v32.5,11.6
  Bottom 0.3: X1.1 5.6,6.06 8.36,6.06 11.2,8.9 24.8,8.9 25.6,9.7 28.5,9.7 29.2,9.1 32.6,9.1 32.7,9.2 32.7,11.22 arc45 32.64,11.36 v32.5,11.6
SWDIO  (via drill 0.5)
  Top 0.3: IC1.34 28.35,8.75 28.1,8.5 v28,8.35 | X1.3 6.56,10.74 v10.6,6.7
  Bottom 0.3: v10.6,6.7 13.8,6.7 15.5,8.4 25,8.4 25.8,9.2 27.15,9.2 v28,8.35
USB_5V  (via drill 0.5)
  Top 0.4: CON3.1 6.6,28.1 7.1,28.6 v7.1,28.9 7.1,29.2 5.23,31.07 LED1.A
  Bottom 0.5: v7.1,28.9 7.51,28.49 D2.A
USB_D+
  Top 0.4: CON3.3 6.9,26.8 7.79,25.91 R34.2
USB_D-
  Top 0.4: CON3.2 6.9,27.45 7.46,28.01 R29.2
USB_DM  (via drill 0.5)
  Top 0.3: IC1.32 27.35,10.95 27.1,11.2 26.6,11.2 v26.5,11.3 | v12.7,27.3 11.99,28.01 R29.1
  Bottom 0.3: v26.5,11.3 25.9,10.7 23.4,10.7 21.2,12.9 21.2,17.2 20.2,18.2 20.2,23.3 19.7,23.8 14.1,23.8 12.7,25.2 v12.7,27.3
USB_DP  (via drill 0.5)
  Top 0.3: IC1.33 27.85,11.25 27,12.1 25.9,12.1 v25.3,11.5 | v13.9,27.3 12.56,25.96 R1.2
  Top 0.4: R34.1 R1.2
  Bottom 0.3: v25.3,11.5 25.1,11.5 24.9,11.3 23.7,11.3 21.9,13.1 21.9,17.4 20.8,18.5 20.8,23.7 20.1,24.4 17.1,24.4 14.2,27.3 v13.9,27.3
USER_LED1  (via drill 0.5)
  Top 0.3: IC1.40 33.75,12.85 34.1,13.2 35.4,13.2 35.7,13.5 35.7,14 36.5,14.8 39,14.8 39.4,14.4 v39.6,14.4
  Bottom 0.3: v39.6,14.4 39.8,14.6 39.8,17 41.3,18.5 R58.1
USER_LED2  (via drill 0.5)
  Top 0.3: IC1.41 33.35,13.35 33.8,13.8 34.8,13.8 36.3,15.3 38,15.3 v38,15.55
  Bottom 0.3: v38,15.55 38,16.8 39.2,18 R59.1
V_BAT  (via drill 0.5)
  Top 0.5: IC5.3 42.22,19.8 R47.2 42.44,19.94 43.1,20.6 43.1,21.6 R10.2 42.9,21.7 42.9,22.6 42.6,22.9 38.3,22.9 37.2,24 v37.2,24.1 | v36.6,32.9 C2.1 34.2,32.9 32.8,34.3 27.3,34.3 26.9,33.9 C1.1 26.9,31.18 IC2.1 26.39,30.67 23.1,30.67 JP1.1
  Bottom 0.5: v36.6,32.9 37.1,32.4 37.1,24.2 v37.2,24.1
VCC  (via drill 0.5)
  Top 0.5: IC5.4 36.62,19.8 C16.1 34.72,20.58 v34.6,20.7 | v12.8,28.5 16,28.5 v17.6,26.9 | v20.6,25.3 22,25.3 23.1,24.2 23.8,24.2 24.4,23.6 24.4,23 25.1,22.3 v25.7,22.3
  Bottom 0.5: v34.6,20.7 31.4,20.7 31.1,21 27.6,21 27.4,21.2 26.4,21.2 25.7,21.9 v25.7,22.3 | D2.C 12.59,28.49 v12.8,28.5 | v20.6,25.3 19.6,26.3 18.6,26.3 18,26.9 v17.6,26.9

### Text on the board
tSilkscreen: 1:GND / 2:3V3 / 3:B10 / 4:B11 / 5:B13 / 6:B14 / 7:B15 | 8:GND / 9:CANH / 10:CANL | 1 | 2 | 3 | 4 | 5 | 6 | 7 | 8 | 9 | 10 | nRF-Beacon
bSilkscreen: BAT / KILL | CANH | PA9 | PA10 | CANL | 9 | 10 | 8 | 10 | nRF-Beacon | GND | v1 / Daniel / 2014 | PB3